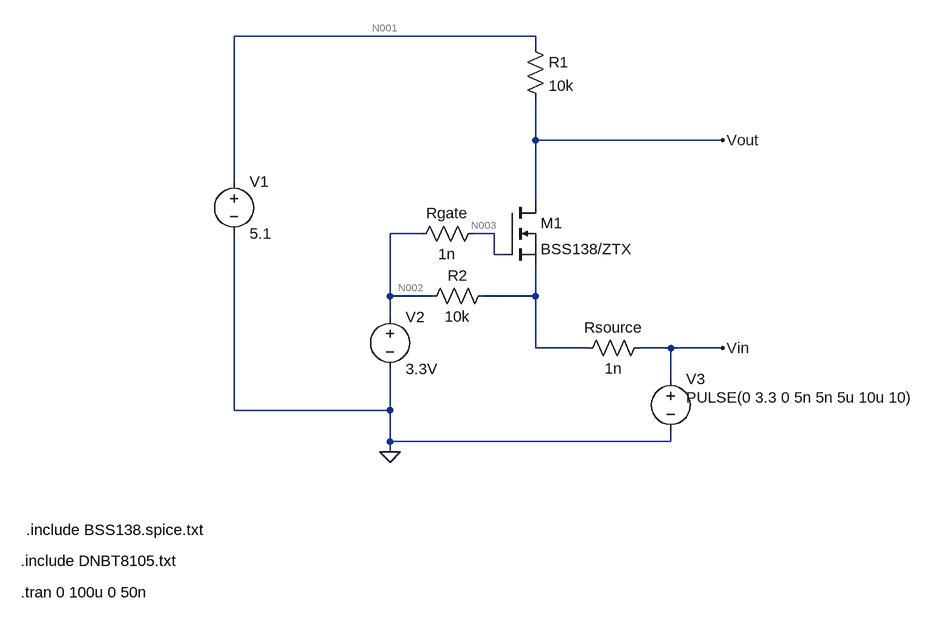
[diagram p0: schematic WS2812Driver.asc]
WS2812Driver.asc, the LTspice schematic file:
Version 4
SHEET 1 1288 680
WIRE 544 -496 80 -496
WIRE 544 -480 544 -496
WIRE 544 -336 544 -400
WIRE 832 -336 544 -336
WIRE 80 -272 80 -496
WIRE 544 -240 544 -336
WIRE 368 -192 320 -192
WIRE 480 -192 448 -192
WIRE 480 -160 480 -192
WIRE 496 -160 480 -160
WIRE 320 -96 320 -192
WIRE 384 -96 320 -96
WIRE 544 -96 544 -144
WIRE 544 -96 464 -96
WIRE 320 -64 320 -96
WIRE 544 -16 544 -96
WIRE 624 -16 544 -16
WIRE 752 -16 704 -16
WIRE 832 -16 752 -16
WIRE 752 32 752 -16
WIRE 80 80 80 -192
WIRE 320 80 320 16
WIRE 320 80 80 80
WIRE 320 128 320 80
WIRE 752 128 752 112
WIRE 752 128 320 128
WIRE 320 144 320 128
FLAG 320 144 0
FLAG 832 -16 Vin
FLAG 832 -336 Vout
SYMBOL voltage 80 -288 R0
WINDOW 123 0 0 Left 0
WINDOW 39 0 0 Left 0
SYMATTR InstName V1
SYMATTR Value 5.1
SYMBOL res 528 -496 R0
SYMATTR InstName R1
SYMATTR Value 10k
SYMBOL voltage 320 -80 R0
WINDOW 123 0 0 Left 0
WINDOW 39 0 0 Left 0
SYMATTR InstName V2
SYMATTR Value 3.3V
SYMBOL res 480 -112 R90
WINDOW 0 0 56 VBottom 2
WINDOW 3 32 56 VTop 2
SYMATTR InstName R2
SYMATTR Value 10k
SYMBOL voltage 752 16 R0
WINDOW 3 24 44 Left 2
WINDOW 123 0 0 Left 0
WINDOW 39 0 0 Left 0
SYMATTR Value PULSE(0 3.3 0 5n 5n 5u 10u 10)
SYMATTR InstName V3
SYMBOL nmos 496 -240 R0
SYMATTR InstName M1
SYMATTR Value BSS138/ZTX
SYMATTR Prefix X
SYMBOL res 464 -208 R90
WINDOW 0 0 56 VBottom 2
WINDOW 3 32 56 VTop 2
SYMATTR InstName Rgate
SYMATTR Value 1n
SYMBOL res 720 -32 R90
WINDOW 0 0 56 VBottom 2
WINDOW 3 32 56 VTop 2
SYMATTR InstName Rsource
SYMATTR Value 1n
TEXT -248 312 Left 2 !.include DNBT8105.txt
TEXT -248 360 Left 2 !.tran 0 100u 0 50n
TEXT -240 264 Left 2 !.include BSS138.spice.txt

The netlist it stands for:
* WS2812Driver.asc
V1 N001 0 5.1
R1 N001 Vout 10k
V2 N002 0 3.3V
R2 N004 N002 10k
V3 Vin 0 PULSE(0 3.3 0 5n 5n 5u 10u 10)
XM1 Vout N003 N004 BSS138/ZTX  ; pins D G S
Rgate N003 N002 1n
Rsource Vin N004 1n
.include DNBT8105.txt
.tran 0 100u 0 50n
.include BSS138.spice.txt
.backanno
.end

* Results of the author's LTspice run, read from the files saved beside the schematic
* Operating Point, zero values left out:
*   V(n001) = 5.1 V
*   V(vout) = 1.367 mV
*   V(n002) = 3.3 V
*   V(n003) = 3.3 V
*   I(R1) = 509.9 µA
*   I(R2) = -330 µA
*   I(Rsource) = -839.9 µA
*   I(V1) = -509.9 µA
*   I(V2) = -330 µA
*   I(V3) = 839.9 µA
*   Ix(m1:3) = 509.9 µA
*   Ix(m1:5) = -509.9 µA
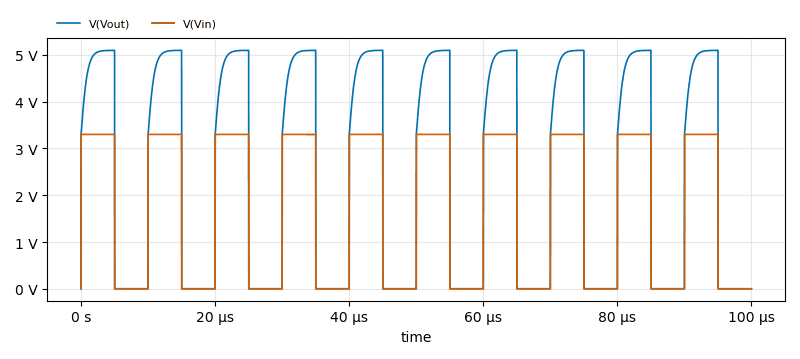
[diagram p1: Transient Analysis of WS2812Driver.asc, plotted from the saved traces]
* Transient Analysis, 1 run:
*   V(Vout): min 1.367 mV, max 5.097 V, average 2.423 V, rms 3.437 V, last 1.367 mV
*   V(Vin): min 0 V, max 3.3 V, average 1.652 V, rms 2.334 V, last 0 V